# Altium schematic sheet DSDADC.SchDoc: DSDADC
size 420 x 297 mm; Date: March 14; CheckedBy: ThS. Bùi Quốc Bảo; DrawnBy: Nguyễn Gia Huy; Revision: V1.0; SheetNumber: 6; SheetTotal: 11; MasterProject: STM32-PLC; Sub-system: DA1_prj.PrjPcb
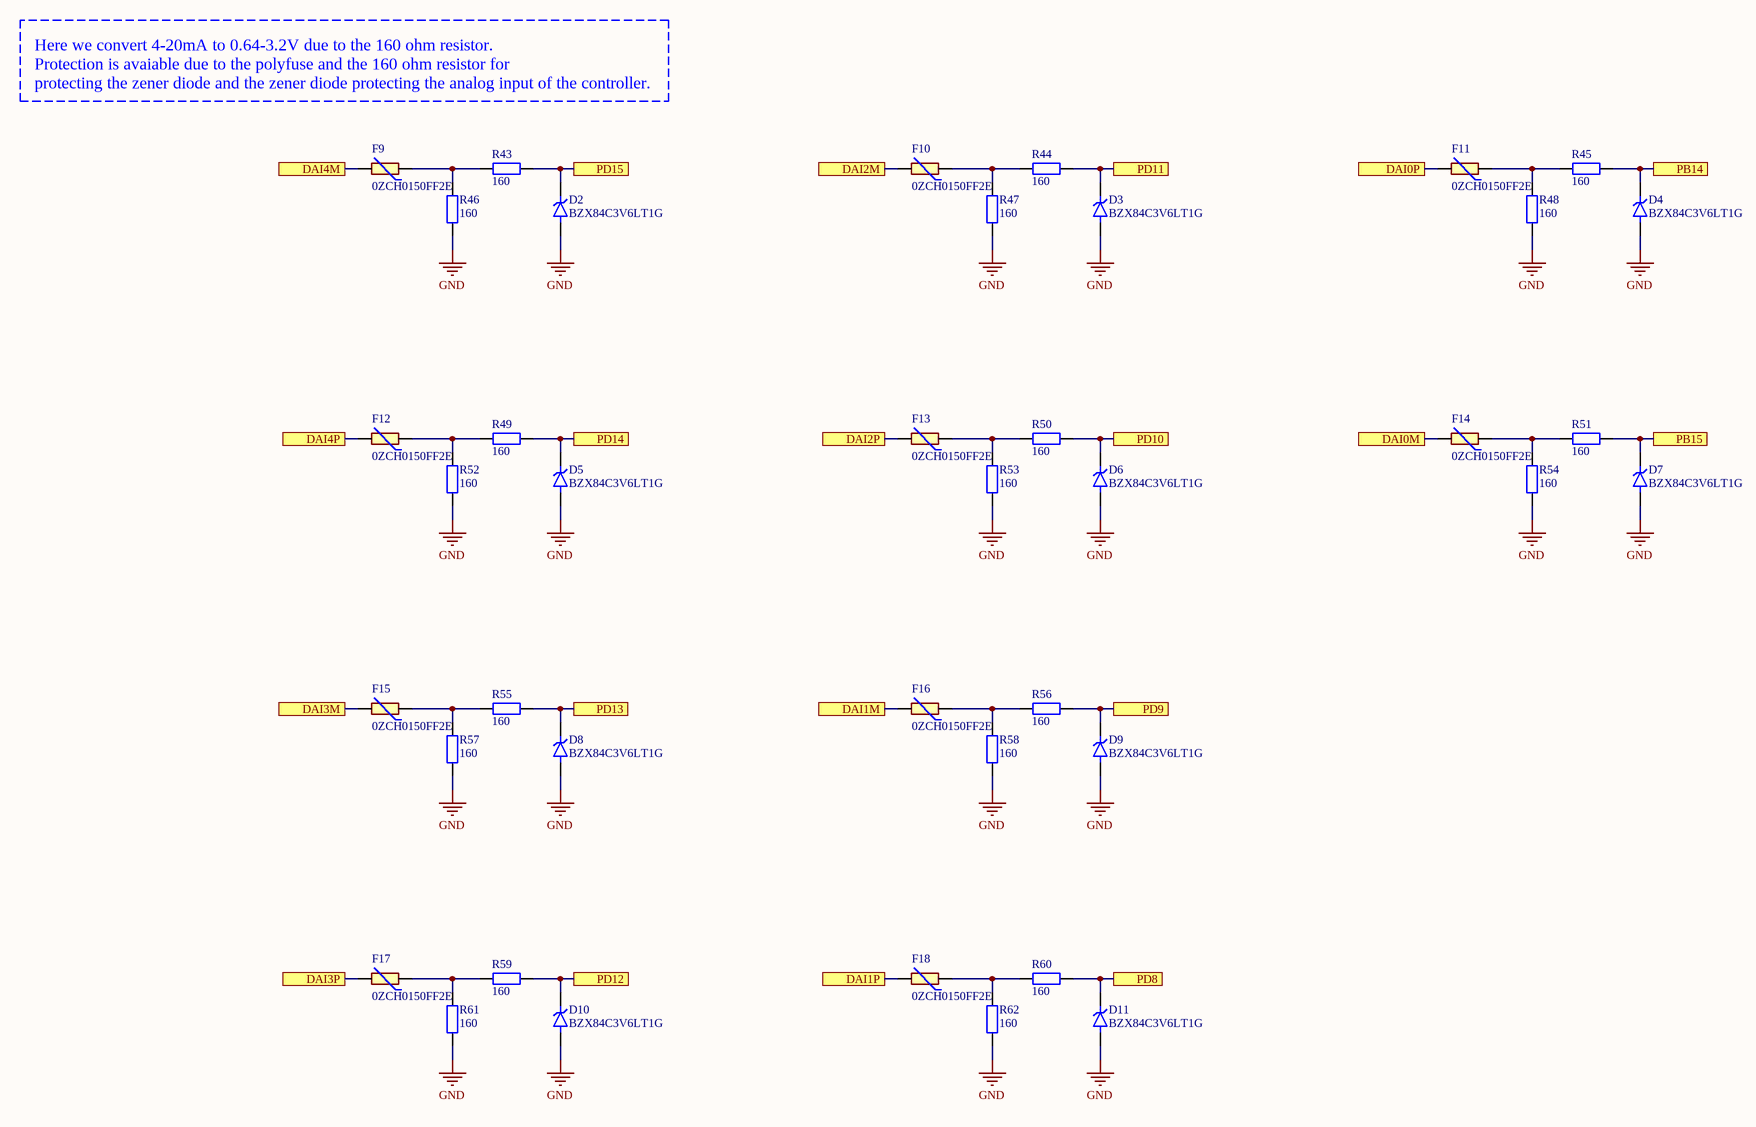
[diagram p0: DSDADC.SchDoc]

## Parts
D2  BZX84C3V6LT1G  [SOT95P240X111-3N]
D3  BZX84C3V6LT1G  [SOT95P240X111-3N]
D4  BZX84C3V6LT1G  [SOT95P240X111-3N]
D5  BZX84C3V6LT1G  [SOT95P240X111-3N]
D6  BZX84C3V6LT1G  [SOT95P240X111-3N]
D7  BZX84C3V6LT1G  [SOT95P240X111-3N]
D8  BZX84C3V6LT1G  [SOT95P240X111-3N]
D9  BZX84C3V6LT1G  [SOT95P240X111-3N]
D10  BZX84C3V6LT1G  [SOT95P240X111-3N]
D11  BZX84C3V6LT1G  [SOT95P240X111-3N]
F9  0ZCH0150FF2E  [FUSC3225X90N]
F10  0ZCH0150FF2E  [FUSC3225X90N]
F11  0ZCH0150FF2E  [FUSC3225X90N]
F12  0ZCH0150FF2E  [FUSC3225X90N]
F13  0ZCH0150FF2E  [FUSC3225X90N]
F14  0ZCH0150FF2E  [FUSC3225X90N]
F15  0ZCH0150FF2E  [FUSC3225X90N]
F16  0ZCH0150FF2E  [FUSC3225X90N]
F17  0ZCH0150FF2E  [FUSC3225X90N]
F18  0ZCH0150FF2E  [FUSC3225X90N]
R43  160  [tro smd 0603]
R44  160  [tro smd 0603]
R45  160  [tro smd 0603]
R46  160  [tro smd 0603]
R47  160  [tro smd 0603]
R48  160  [tro smd 0603]
R49  160  [tro smd 0603]
R50  160  [tro smd 0603]
R51  160  [tro smd 0603]
R52  160  [tro smd 0603]
R53  160  [tro smd 0603]
R54  160  [tro smd 0603]
R55  160  [tro smd 0603]
R56  160  [tro smd 0603]
R57  160  [tro smd 0603]
R58  160  [tro smd 0603]
R59  160  [tro smd 0603]
R60  160  [tro smd 0603]
R61  160  [tro smd 0603]
R62  160  [tro smd 0603]

## Ports
DAI0M (see STM32_PLC[4D]), DAI0P (see STM32_PLC[4D]), DAI1M (see STM32_PLC[4D]), DAI1P (see STM32_PLC[4D]), DAI2M (see STM32_PLC[4C]), DAI2P (see STM32_PLC[4D]), DAI3M (see STM32_PLC[4C]), DAI3P (see STM32_PLC[4C]), DAI4M (see STM32_PLC[4C]), DAI4P (see STM32_PLC[4C]), PB14 (see STM32_PLC[2B], STM32_PLC[4D]), PB15 (see STM32_PLC[2B], STM32_PLC[4D]), PD8 (see STM32_PLC[3C], STM32_PLC[4D]), PD9 (see STM32_PLC[3C], STM32_PLC[4D]), PD10 (see STM32_PLC[3C], STM32_PLC[4D]), PD11 (see STM32_PLC[3C], STM32_PLC[4C]), PD12 (see STM32_PLC[3C], STM32_PLC[4C]), PD13 (see STM32_PLC[3C], STM32_PLC[4C]), PD14 (see STM32_PLC[3C], STM32_PLC[4C]), PD15 (see STM32_PLC[3C], STM32_PLC[4C])

## Nets
GND: D2.1(A) D3.1(A) D4.1(A) D5.1(A) D6.1(A) D7.1(A) D8.1(A) D9.1(A) D10.1(A) D11.1(A) R46.1 R47.1 R48.1 R52.1 R53.1 R54.1 R57.1 R58.1 R61.1 R62.1
DAI0M: F14.2 ; port DAI0M
DAI0P: F11.2 ; port DAI0P
DAI1M: F16.2 ; port DAI1M
DAI1P: F18.2 ; port DAI1P
DAI2M: F10.2 ; port DAI2M
DAI2P: F13.2 ; port DAI2P
DAI3M: F15.2 ; port DAI3M
DAI3P: F17.2 ; port DAI3P
DAI4M: F9.2 ; port DAI4M
DAI4P: F12.2 ; port DAI4P
PB14: D4.3(K) R45.2 ; port PB14
PB15: D7.3(K) R51.2 ; port PB15
PD8: D11.3(K) R60.2 ; port PD8
PD9: D9.3(K) R56.2 ; port PD9
PD10: D6.3(K) R50.2 ; port PD10
PD11: D3.3(K) R44.2 ; port PD11
PD12: D10.3(K) R59.2 ; port PD12
PD13: D8.3(K) R55.2 ; port PD13
PD14: D5.3(K) R49.2 ; port PD14
PD15: D2.3(K) R43.2 ; port PD15
NetF9_1: F9.1 R43.1 R46.2
NetF10_1: F10.1 R44.1 R47.2
NetF11_1: F11.1 R45.1 R48.2
NetF12_1: F12.1 R49.1 R52.2
NetF13_1: F13.1 R50.1 R53.2
NetF14_1: F14.1 R51.1 R54.2
NetF15_1: F15.1 R55.1 R57.2
NetF16_1: F16.1 R56.1 R58.2
NetF17_1: F17.1 R59.1 R61.2
NetF18_1: F18.1 R60.1 R62.2

## Notes on the sheet
- Here we convert 4-20mA to 0.64-3.2V due to the 160 ohm resistor.
  Protection is avaiable due to the polyfuse and the 160 ohm resistor for
  protecting the zener diode and the zener diode protecting the analog input of the controller.
- Sub-system:
- Project:
- Design by:
- Sheet title:
- Sheet
- of
- Checked by:
- Approved by:
- Doc No:
- Revision:
- Size:
- Dates:
- A3

## Library data of the parts
F9-F18 = 0ZCH0150FF2E: 1210 SMT PPTC | 1.50 Ih | 6V; MF: Bel Fuse; SnapEDA_Link: https://www.snapeda.com/parts/0ZCH0150FF2E/Bel+Circuit+Protection/view-part/?ref=snap; Package: Package; Value: *; MP: 0ZCH0150FF2E; Check_prices: https://www.snapeda.com/parts/0ZCH0150FF2E/Bel+Circuit+Protection/view-part/?ref=eda
R43-R62 = Tro 0603 1% 10k: RES; Chung_Loai: Dán; Don_Vi: Con; So_Chan: 2; Ten_Linh_Kien: Trở 0603 1% 10k; Ma_Hang: MH006333; Kieu_Chan: *
D2-D11 = BZX84C3V6LT1G: Package: None; Price: None; Value: *; MP: BZX84C3V6LT1G; Availability: Unavailable